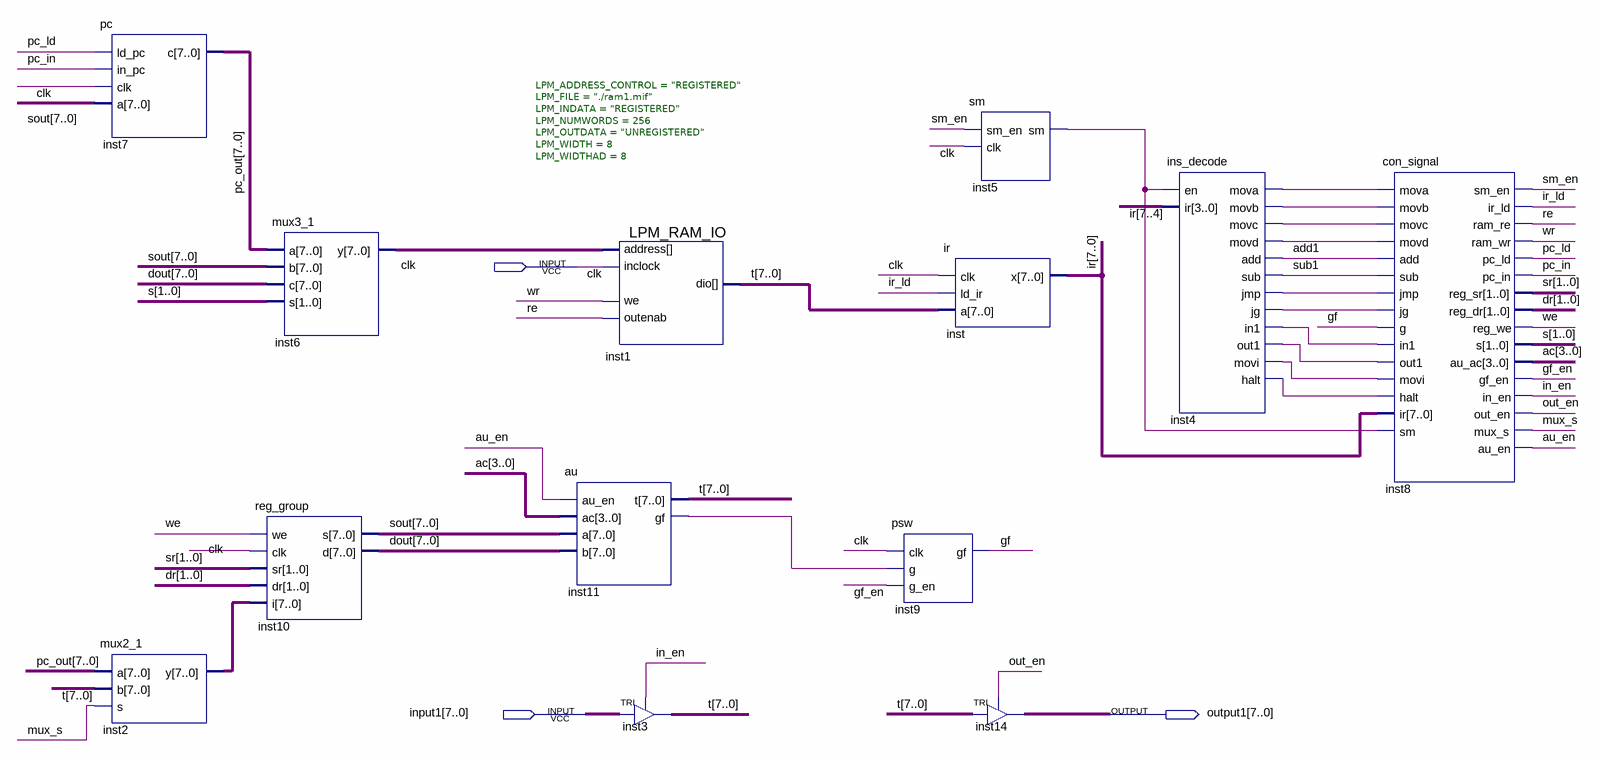
[diagram p0: schematic sheet]
// Quartus schematic small_computer.bdf as structural Verilog: 13 symbols, 3 pins
module small_computer (
  input  clk,
  input  [7:0] input1,
  output [7:0] output1
);

  wire add1, au_en, gf, gf_en, in_en, inst4_halt, inst4_in1, inst4_jg, inst4_jmp, inst4_mova, inst4_movb,
       inst4_movc, inst4_movd, inst4_movi, inst4_out1, inst5_sm, inst11_gf, ir_ld, mux_s, out_en, pc_in,
       pc_ld, re, sm_en, sub1, we, wr;
  wire [1:0] dr, s, sr;
  wire [3:0] ac;
  wire [7:0] dout, inst2_y, inst6_y, ir, pc_out, sout, t;

  pc inst7 (.ld_pc(pc_ld), .in_pc(pc_in), .clk(clk), .a(sout), .c(pc_out));
  mux2_1 inst2 (.a(pc_out), .b(t), .s(mux_s), .y(inst2_y));
  reg_group inst10 (.we(we), .clk(clk), .sr(sr), .dr(dr), .i(inst2_y), .s(sout), .d(dout));
  mux3_1 inst6 (.a(pc_out), .b(sout), .c(dout), .s(s), .y(inst6_y));
  au inst11 (.au_en(au_en), .ac(ac), .a(sout), .b(dout), .t(t), .gf(inst11_gf));
  LPM_RAM_IO #(.LPM_ADDRESS_CONTROL("REGISTERED"), .LPM_FILE("./ram1.mif"), .LPM_INDATA("REGISTERED"), .LPM_NUMWORDS(256), .LPM_OUTDATA("UNREGISTERED"), .LPM_WIDTH(8), .LPM_WIDTHAD(8)) inst1 (
    .address(inst6_y), .inclock(clk), .we(wr), .outenab(re), .dio(t));
  TRI inst3[7:0] (.IN(input1), .OE(in_en), .OUT(t));
  ir inst (.clk(clk), .ld_ir(ir_ld), .a(t), .x(ir));
  psw inst9 (.clk(clk), .g(inst11_gf), .g_en(gf_en), .gf(gf));
  sm inst5 (.sm_en(sm_en), .clk(clk), .sm(inst5_sm));
  TRI inst14[7:0] (.IN(t), .OE(out_en), .OUT(output1));
  ins_decode inst4 (
    .en(inst5_sm), .ir(ir[7:4]), .mova(inst4_mova), .movb(inst4_movb), .movc(inst4_movc), .movd(inst4_movd),
    .add(add1), .sub(sub1), .jmp(inst4_jmp), .jg(inst4_jg), .in1(inst4_in1), .out1(inst4_out1),
    .movi(inst4_movi), .halt(inst4_halt));
  con_signal inst8 (
    .mova(inst4_mova), .movb(inst4_movb), .movc(inst4_movc), .movd(inst4_movd), .add(add1), .sub(sub1),
    .jmp(inst4_jmp), .jg(inst4_jg), .g(gf), .in1(inst4_in1), .out1(inst4_out1), .movi(inst4_movi),
    .halt(inst4_halt), .ir(ir), .sm(inst5_sm), .sm_en(sm_en), .ir_ld(ir_ld), .ram_re(re), .ram_wr(wr),
    .pc_ld(pc_ld), .pc_in(pc_in), .reg_sr(sr), .reg_dr(dr), .reg_we(we), .s(s), .au_ac(ac), .gf_en(gf_en),
    .in_en(in_en), .out_en(out_en), .mux_s(mux_s), .au_en(au_en));
endmodule
